# EAGLE design dual-dac-w-32-ch-sh-DAC-BOARD (EAGLE 7.2.0)
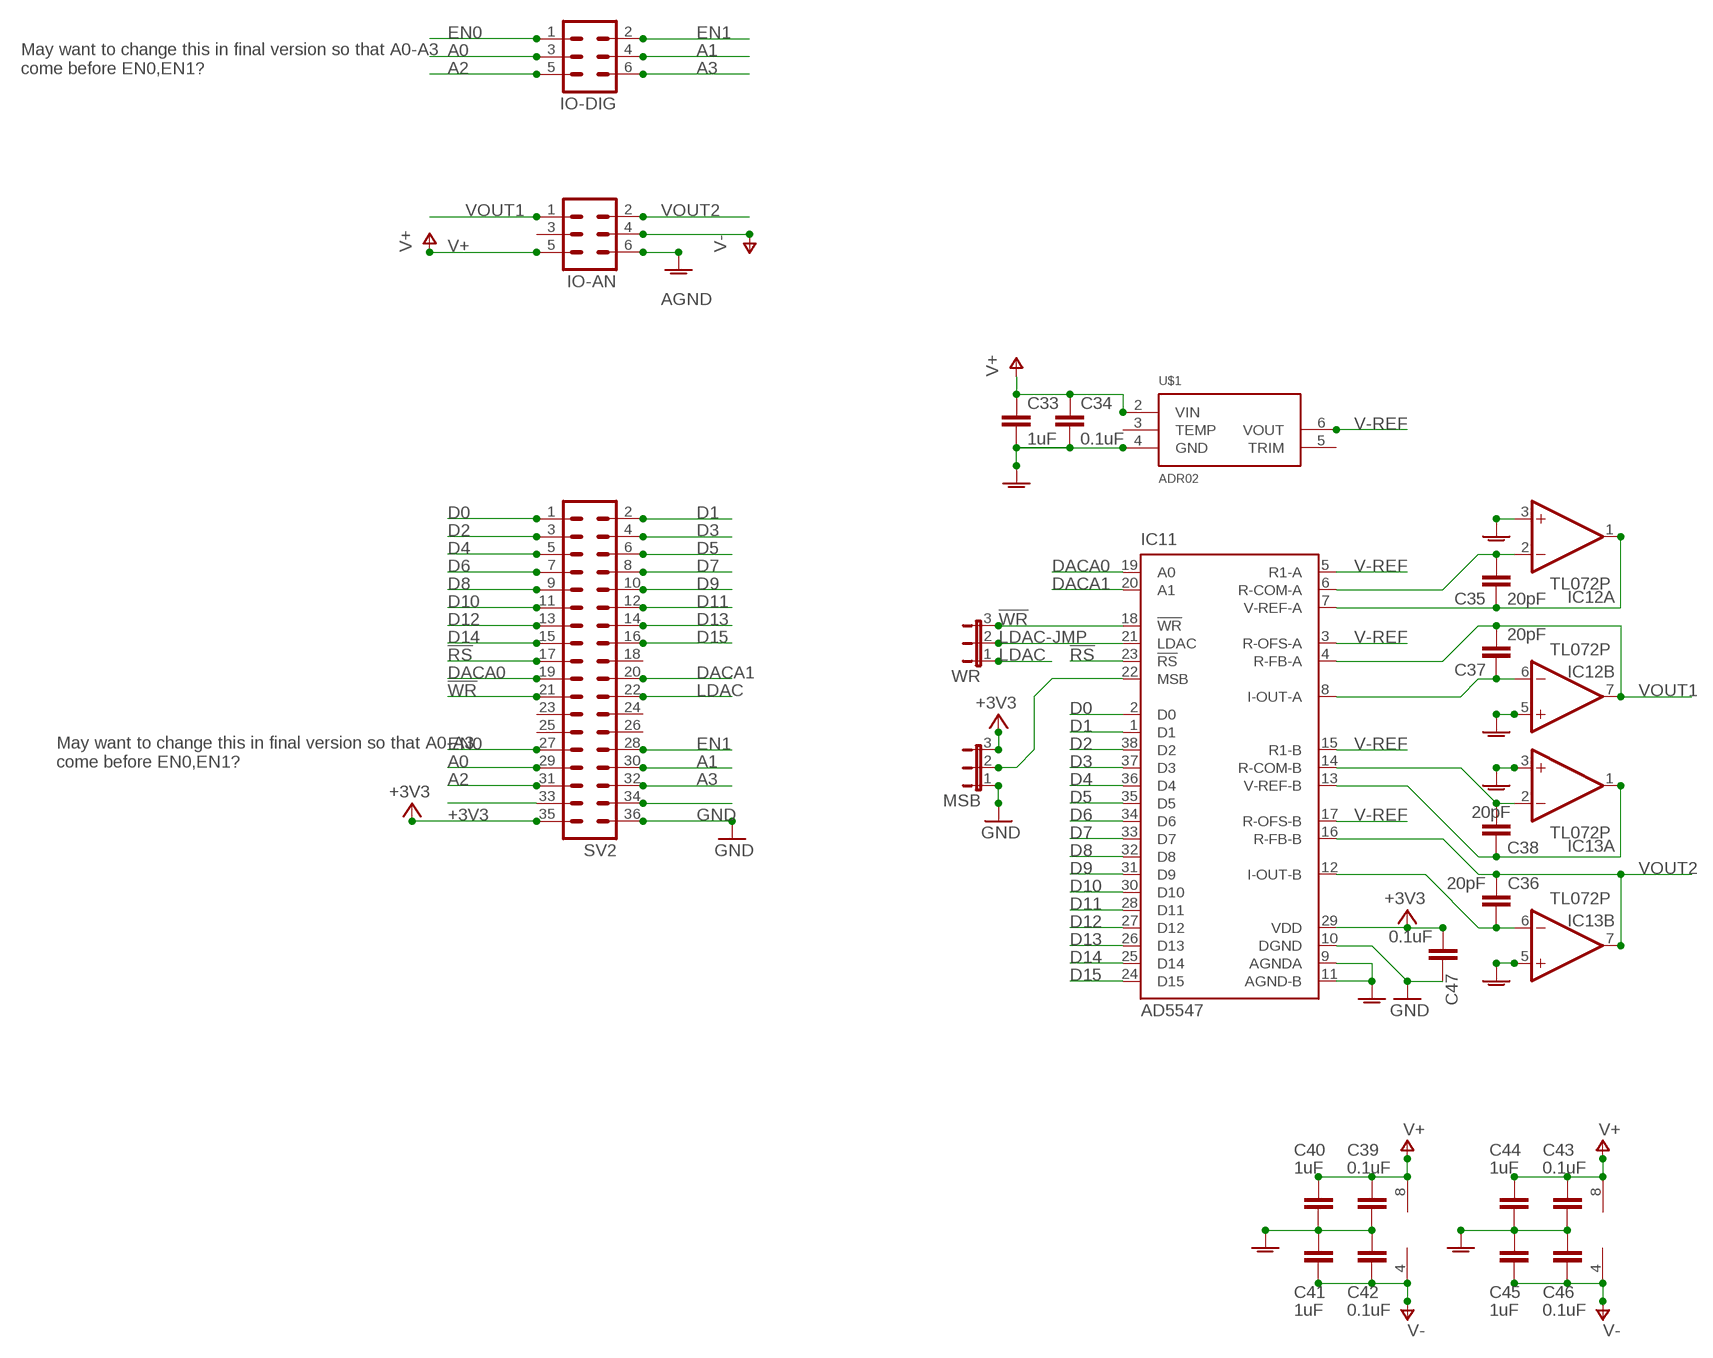
[diagram p0: schematic, sheet 1]

## Parts
C33  1uF  C-EUC0603  [C0603]
C34  0.1uF  C-EUC0603  [C0603]
C35  20pF  C-EUC0603  [C0603]
C36  20pF  C-EUC0603  [C0603]
C37  20pF  C-EUC0603  [C0603]
C38  20pF  C-EUC0603  [C0603]
C39  0.1uF  C-EUC0603  [C0603]
C40  1uF  C-EUC0603  [C0603]
C41  1uF  C-EUC0603  [C0603]
C42  0.1uF  C-EUC0603  [C0603]
C43  0.1uF  C-EUC0603  [C0603]
C44  1uF  C-EUC0603  [C0603]
C45  1uF  C-EUC0603  [C0603]
C46  0.1uF  C-EUC0603  [C0603]
C47  0.1uF  C-EUC0603  [C0603]
IC11  AD5547  [TSSOP38]
IC12  TL072P  [DIL08]
IC13  TL072P  [DIL08]
IO-AN  MA03-2  [MA03-2]
IO-DIG  MA03-2  [MA03-2]
MSB  JP2E  [JP2]
SV2  MA18-2  [MA18-2]
U$1  ADR02  [SO08]
WR  JP2E  [JP2]

## Nets
!RS: IC11.23(!RS) SV2.17
!WR: IC11.18(!WR) SV2.21 WR.3
+3V3: C47.1 IC11.29(VDD) MSB.3 SV2.35
A0: IO-DIG.3 SV2.29
A1: IO-DIG.4 SV2.30
A2: IO-DIG.5 SV2.31
A3: IO-DIG.6 SV2.32
AGND: C33.2 C34.2 C39.1 C40.1 C41.2 C42.2 C43.1 C44.1 C45.2 C46.2 IC11.9(AGNDA) IC11.11(AGND-B) IC12.3(A:+IN) IC12.5(B:+IN) IC13.3(A:+IN) IC13.5(B:+IN) IO-AN.6 U$1.4(GND)
D0: IC11.2(D0) SV2.1
D1: IC11.1(D1) SV2.2
D2: IC11.38(D2) SV2.3
D3: IC11.37(D3) SV2.4
D4: IC11.36(D4) SV2.5
D5: IC11.35(D5) SV2.6
D6: IC11.34(D6) SV2.7
D7: IC11.33(D7) SV2.8
D8: IC11.32(D8) SV2.9
D9: IC11.31(D9) SV2.10
D10: IC11.30(D10) SV2.11
D11: IC11.28(D11) SV2.12
D12: IC11.27(D12) SV2.13
D13: IC11.26(D13) SV2.14
D14: IC11.25(D14) SV2.15
D15: IC11.24(D15) SV2.16
DACA0: IC11.19(A0) SV2.19
DACA1: IC11.20(A1) SV2.20
EN0: IO-DIG.1 SV2.27
EN1: IO-DIG.2 SV2.28
GND: C47.2 IC11.10(DGND) MSB.1 SV2.36
LDAC: SV2.22 WR.1
LDAC-JMP: IC11.21(LDAC) WR.2
N$1: C35.2 IC11.6(R-COM-A) IC12.2(A:-IN)
N$2: C35.1 IC11.7(V-REF-A) IC12.1(A:OUT)
N$3: C38.2 IC11.14(R-COM-B) IC13.2(A:-IN)
N$5: C38.1 IC11.13(V-REF-B) IC13.1(A:OUT)
N$6: IC11.22(MSB) MSB.2
N$7: C36.2 IC11.12(I-OUT-B) IC13.6(B:-IN)
N$10: C37.2 IC11.8(I-OUT-A) IC12.6(B:-IN)
N$12: SV2.33
N$16: SV2.34
V+: C33.1 C34.1 C39.2 C40.2 C43.2 C44.2 IC12.8(P:V+) IC13.8(P:V+) IO-AN.5 U$1.2(VIN)
V-: C41.1 C42.1 C45.1 C46.1 IC12.4(P:V-) IC13.4(P:V-) IO-AN.4
V-REF: IC11.3(R-OFS-A) IC11.5(R1-A) IC11.15(R1-B) IC11.17(R-OFS-B) U$1.6(VOUT)
VOUT1: C37.1 IC11.4(R-FB-A) IC12.7(B:OUT) IO-AN.1
VOUT2: C36.1 IC11.16(R-FB-B) IC13.7(B:OUT) IO-AN.2
Unconnected: IO-AN.3 SV2.18 SV2.23 SV2.24 SV2.25 SV2.26 U$1.3(TEMP) U$1.5(TRIM)

## Notes on the sheet
- May want to change this in final version so that A0-A3 
  come before EN0,EN1?
- May want to change this in final version so that A0-A3 
  come before EN0,EN1?

## Library data of the parts
C33-C47 = resistor:C-EU: CAPACITOR, European symbol
IC11 = joakim:AD5547: Dual-Current Output, Parallel Input 16 bit Multiplying DAC Source: http://www.analog.com/media/en/technical-documentation/data-sheets/AD5547_5557.pdf
IC12 IC13 = linear:TL072: OP AMP
IO-AN IO-DIG = con-lstb:MA03-2: PIN HEADER; OC_FARNELL: unknown; OC_NEWARK: unknown
MSB WR = jumper:JP2E: JUMPER
SV2 = con-lstb:MA18-2: PIN HEADER; OC_FARNELL: unknown; OC_NEWARK: unknown
U$1 = joakim:ADR02: Ultracompact Precision 5.0V Voltage Reference Analog Devices http://docs-europe.electrocomponents.com/webdocs/10ad/0900766b810adbed.pdf

## Board
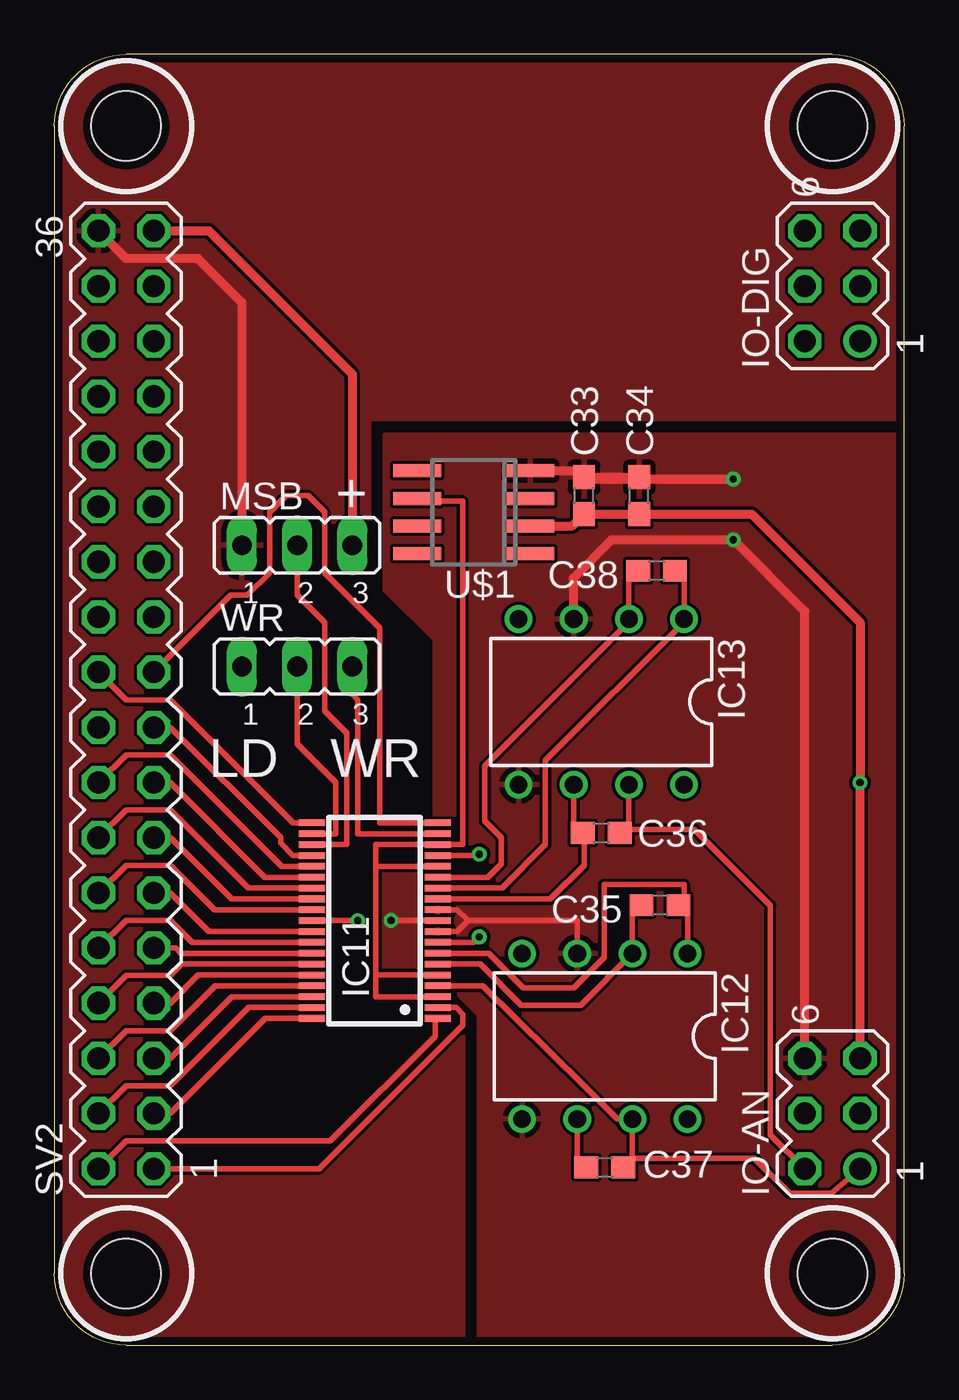
[diagram p1: board, top side]
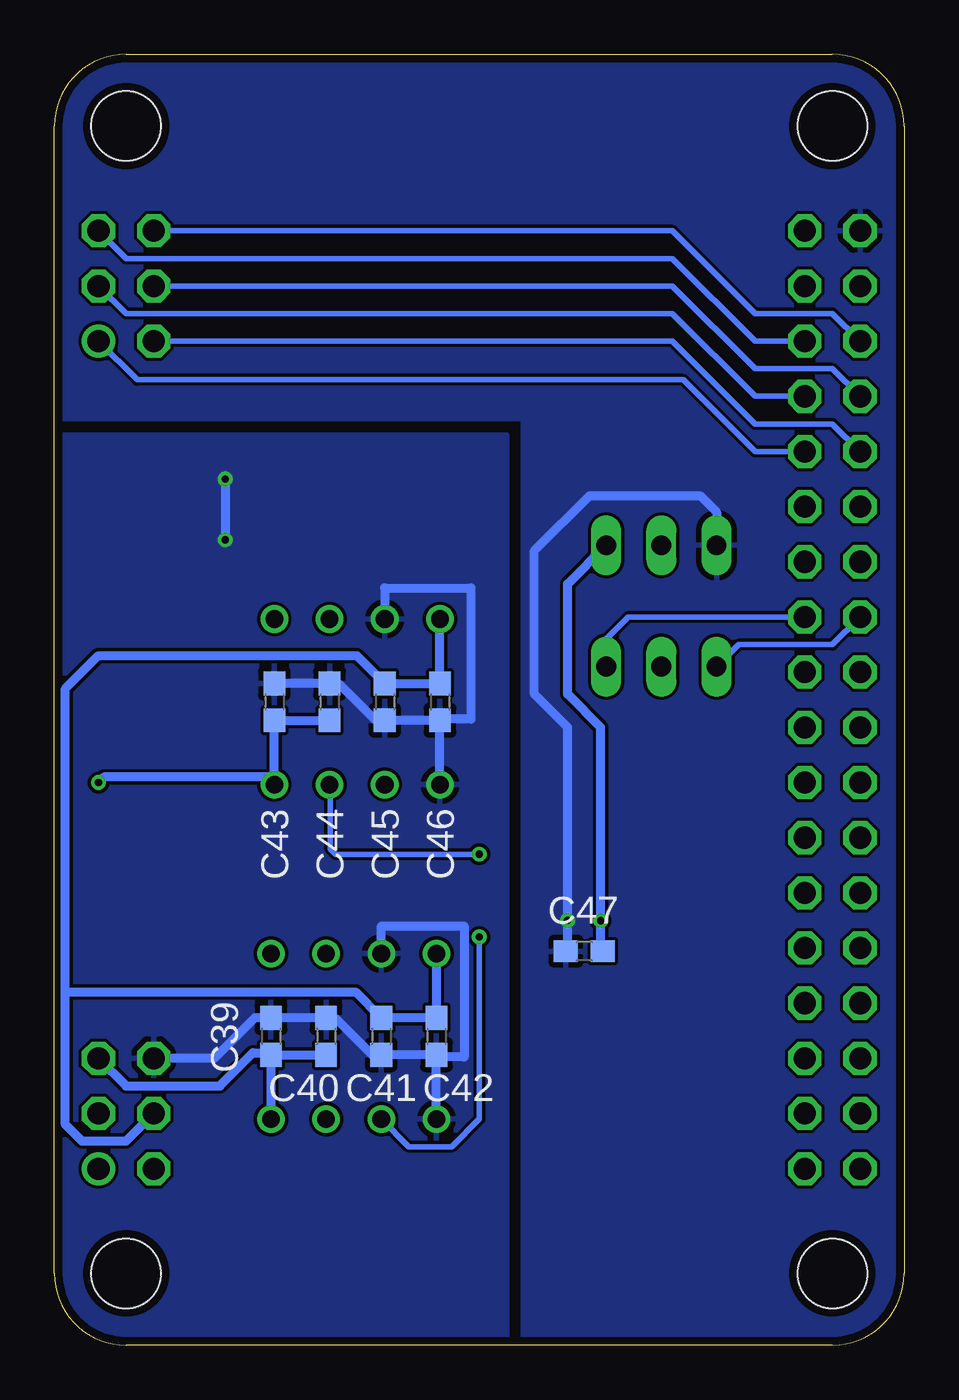
[diagram p2: board, bottom side, seen from below]

Size 39.12 x 59.44 mm. Coordinates in mm from the lower left corner, seen from the top.
Outline: 3.3,0 35.81,0 arc90 39.12,3.3 39.12,56.13 arc90 35.81,59.44 3.3,59.44 arc90 0,56.13 0,3.3 arc90 3.3,0
Copper layers (1*16): Top 0.0356mm / dielectric 1.5011mm / Bottom 0.0356mm
Design rules "LaenPCBOrder": minimum track width 6mil, minimum drill 13mil, track to track 6mil, track to pad 6mil, pad to pad 6mil, via to via 6mil, smd to smd 6mil, copper to edge 15mil, drill to drill 6mil, minimum pad ring 7mil, minimum via ring 7mil, stop-mask expansion 3mil, vias tented up to drill 0mil, thermal gap 10mil
Holes 3.2 mm at 3.3,56.13 35.81,56.13 3.3,3.3 35.81,3.3

### Footprints (pad centres in the part's own frame; a part is rotated, then mirrored left to right if it is on the bottom)
C0603 = smd 1.1 x 1: 1 -0.85,0; 2 0.85,0
TSSOP38 = smd 0.3 x 1.2: 1 -4.5,-2.9; 2 -4,-2.9; 3 -3.5,-2.9; 4 -3,-2.9; 5 -2.5,-2.9; 6 -2,-2.9; 7 -1.5,-2.9; 8 -1,-2.9; 9 -0.5,-2.9; 10 0,-2.9; 11 0.5,-2.9; 12 1,-2.9; 13 1.5,-2.9; 14 2,-2.9; 15 2.5,-2.9; 16 3,-2.9; 17 3.5,-2.9; 18 4,-2.9; 19 4.5,-2.9; 20 4.5,2.9; 21 4,2.9; 22 3.5,2.9; 23 3,2.9; 24 2.5,2.9; 25 2,2.9; 26 1.5,2.9; 27 1,2.9; 28 0.5,2.9; 29 0,2.9; 30 -0.5,2.9; 31 -1,2.9; 32 -1.5,2.9; 33 -2,2.9; 34 -2.5,2.9; 35 -3,2.9; 36 -3.5,2.9; 37 -4,2.9; 38 -4.5,2.9
DIL08 = drill 0.813 pad 1.27: 1 -3.81,-3.81; 2 -1.27,-3.81; 3 1.27,-3.81; 4 3.81,-3.81; 5 3.81,3.81; 6 1.27,3.81; 7 -1.27,3.81; 8 -3.81,3.81
MA03-2 = drill 1.016: 1 -2.54,-1.27 | drill 1.016 octagon: 2 -2.54,1.27; 3 0,-1.27; 4 0,1.27; 5 2.54,-1.27; 6 2.54,1.27
JP2 = drill 0.914 long: 1 -2.54,0; 2 0,0; 3 2.54,0
MA18-2 = drill 1.016 octagon: 1 -21.59,-1.27; 2 -21.59,1.27; 3 -19.05,-1.27; 4 -19.05,1.27; 5 -16.51,-1.27; 6 -16.51,1.27; 7 -13.97,-1.27; 8 -13.97,1.27; 9 -11.43,-1.27; 10 -11.43,1.27; 11 -8.89,-1.27; 12 -8.89,1.27; 13 -6.35,-1.27; 14 -6.35,1.27; 15 -3.81,-1.27; 16 -3.81,1.27; 17 -1.27,-1.27; 18 -1.27,1.27; 19 1.27,-1.27; 20 1.27,1.27; 21 3.81,-1.27; 22 3.81,1.27; 23 6.35,-1.27; 24 6.35,1.27; 25 8.89,-1.27; 26 8.89,1.27; 27 11.43,-1.27; 28 11.43,1.27; 29 13.97,-1.27; 30 13.97,1.27; 31 16.51,-1.27; 32 16.51,1.27; 33 19.05,-1.27; 34 19.05,1.27; 35 21.59,-1.27; 36 21.59,1.27
SO08 = smd 0.6 x 2.2: 1 -1.905,-2.6; 2 -0.635,-2.6; 3 0.635,-2.6; 4 1.905,-2.6; 5 1.905,2.6; 6 0.635,2.6; 7 -0.635,2.6; 8 -1.905,2.6

### Placement (x,y rotation side)
C33  24.38,39.12 90 top
C34  26.92,39.12 90 top
C35  27.88,20.26 180 top
C36  25.18,23.59 180 top
C37  25.34,8.19 180 top
C38  27.72,35.66 180 top
C39  29.15,14.22 270 bottom
C40  26.61,14.22 270 bottom
C41  24.07,14.22 270 bottom
C42  21.53,14.22 270 bottom
C43  28.99,29.62 270 bottom
C44  26.45,29.62 270 bottom
C45  23.91,29.62 270 bottom
C46  21.37,29.62 270 bottom
C47  14.72,18.14 180 bottom
IC11  14.74,19.55 90 top
IC12  25.34,14.22 180 top
IC13  25.18,29.62 180 top
IO-AN  35.81,10.67 90 top
IO-DIG  35.81,48.77 90 top
MSB  11.18,36.83 0 top
SV2  3.3,29.72 90 top
U$1  19.3,38.35 90 top
WR  11.18,31.24 0 top

### Tracks (layer width: path | path; a pad name or v marks a point on that pad's centre or on a via)
!RS
  Top 0.254: SV2.17 5.33,28.45 10.41,23.37 10.41,23.11 10.98,22.55 IC11.23
!WR
  Top 0.254: IC11.18 13.97,23.55 13.97,29.72 13.72,29.97 WR.3
  Bottom 0.254: SV2.21 12.7,33.53 13.72,32.51 WR.3
+3V3  (via drill 0.33)
  Top 0.254: IC11.29 v13.97,19.55
  Top 0.406: SV2.35 7.11,51.31 13.72,44.7 MSB.3
  Bottom 0.406: MSB.3 15.49,35.05 15.49,29.97 13.97,28.45 v13.97,19.55 13.97,18.03 C47.1
A0
  Bottom 0.254: SV2.29 6.86,43.69 10.67,47.5 35.81,47.5 IO-DIG.3
A1
  Bottom 0.254: SV2.30 3.3,44.96 6.86,44.96 10.67,48.77 IO-DIG.4
A2
  Bottom 0.254: SV2.31 6.86,46.23 10.67,50.04 35.81,50.04 IO-DIG.5
A3
  Bottom 0.254: SV2.32 3.3,47.5 6.86,47.5 10.67,51.31 IO-DIG.6
AGND  (via drill 0.33)
  Top 0.254: 17.64,19.07 IC11.9 18.54,19.05 19.05,19.56 | 19.05,19.56 18.54,20.05 IC11.11 | 19.05,19.56 24.07,19.56 IC12.3
  Top 0.406: IO-AN.6 34.54,33.78 v31.24,37.08 25.65,37.08 23.88,35.31 23.88,33.46 IC13.3 | C34.2 C33.2 24.09,40.26 U$1.4 24.26,40.26 24.64,39.88 v31.24,39.88
  Bottom 0.406: IC12.5 C42.2 | C42.2 C41.2 24.49,13.37 26.13,15.02 26.55,15.02 C40.1 C39.1 29.88,15.07 31.75,13.21 IO-AN.6 | IC13.5 C46.2 | C46.2 C45.2 24.33,28.77 25.97,30.42 26.39,30.42 C44.1 C43.1 | IC12.3 24.07,19.3 20.26,19.3 20.26,13.27 21.42,13.27 C42.2 | IC13.3 23.91,33.56 | C46.2 21.31,28.83 19.94,28.83 19.94,34.86 23.91,34.86 23.91,33.56 | 23.91,33.56 23.88,33.53 | v31.24,39.88 v31.24,37.08
  pour Top: 19.56,15.24 19.56,-0.76 39.88,-0.76 39.88,0 39.88,41.91 15.24,41.91 15.24,35.31 15.24,34.8 17.53,32.51 17.53,17.27
  pour Bottom: 40.13,-1.02 40.13,41.91 18.29,41.91 18.29,-1.02
D0
  Top 0.254: SV2.1 12.19,8.13 18.8,14.73 18.8,15.24 18.49,15.55 IC11.2
D1
  Top 0.254: SV2.2 3.3,9.4 12.7,9.4 17.53,14.22 17.53,14.93 IC11.1
D2
  Top 0.254: IC11.38 9.71,15.05 5.33,10.67 SV2.3
D3
  Top 0.254: IC11.37 8.94,15.55 5.33,11.94 3.3,11.94 SV2.4
D4
  Top 0.254: IC11.36 8.17,16.05 5.33,13.21 SV2.5
D5
  Top 0.254: IC11.35 7.4,16.55 5.33,14.48 3.3,14.48 SV2.6
D6
  Top 0.254: IC11.34 6.63,17.05 5.33,15.75 SV2.7
D7
  Top 0.254: IC11.33 5.86,17.55 5.33,17.02 3.3,17.02 SV2.8
D8
  Top 0.254: IC11.32 5.83,18.05 5.59,18.29 SV2.9
D9
  Top 0.254: IC11.31 6.34,18.55 5.33,19.56 3.3,19.56 SV2.10
D10
  Top 0.254: IC11.30 7.12,19.05 5.33,20.83 SV2.11
D11
  Top 0.254: IC11.28 7.38,20.05 5.33,22.1 3.3,22.1 SV2.12
D12
  Top 0.254: IC11.27 8.15,20.55 5.33,23.37 SV2.13
D13
  Top 0.254: IC11.26 8.93,21.05 5.33,24.64 3.3,24.64 SV2.14
D14
  Top 0.254: IC11.25 9.7,21.55 5.33,25.91 SV2.15
D15
  Top 0.254: IC11.24 10.46,22.05 5.33,27.18 3.3,27.18 SV2.16
DACA0
  Top 0.254: SV2.19 8.13,34.54 8.89,34.54 9.91,35.56 9.91,38.35 10.67,39.12 11.68,39.12 12.45,38.35 12.45,35.56 14.99,33.02 14.99,24.05 IC11.19
DACA1
  Top 0.254: SV2.20 3.3,29.72 5.33,29.72 11.01,24.05 IC11.20
EN0
  Bottom 0.254: SV2.27 6.86,41.15 10.16,44.45 35.31,44.45 IO-DIG.1
EN1
  Bottom 0.254: SV2.28 3.3,42.42 6.86,42.42 10.67,46.23 IO-DIG.2
GND  (via drill 0.33)
  Top 0.254: IC11.10 15.53,19.55 | 15.49,19.51 15.53,19.55 | 15.53,19.55 15.51,19.55 v15.49,19.56
  Top 0.406: SV2.36 3.3,50.04 6.6,50.04 8.64,48.01 MSB.1
  Bottom 0.406: MSB.1 8.64,38.35 9.4,39.12 14.48,39.12 17.02,36.58 17.02,29.97 15.49,28.45 v15.49,19.56 15.49,18.03 15.57,18.11 C47.2
  pour Bottom: 39.88,42.67 17.53,42.67 17.53,-0.76 -0.76,-0.76 -0.76,59.94 39.62,59.94 39.62,43.43 39.88,43.43
  pour Top: -0.51,60.2 39.88,60.2 39.88,42.67 39.62,42.67 14.48,42.67 14.48,34.54 16.76,32.26 16.76,16.51 18.8,14.48 18.8,0.25 0.51,0.25 0.51,56.9 -0.76,58.17 -0.76,59.94
LDAC
  Bottom 0.254: SV2.22 3.3,32.26 7.62,32.26 WR.1
LDAC-JMP
  Top 0.254: WR.2 11.18,27.69 12.95,25.91 12.95,23.55 IC11.21
N$1
  Top 0.254: C35.2 26.61,19.84 IC12.2 24.23,15.65 21.5,15.65 19.6,17.55 IC11.6
N$2
  Top 0.254: IC12.1 29.15,19.84 C35.1 28.99,20.52 28.99,21.21 25.3,21.21 25.3,17.84 23.91,16.45 21.59,16.45 19.99,18.05 IC11.7
N$3
  Top 0.254: C38.2 26.45,35.23 IC13.2 26.45,33.31 19.81,26.67 19.81,24.13 20.57,23.37 20.57,22.16 19.96,21.55 IC11.14
N$5
  Top 0.254: C38.1 28.99,35.23 IC13.1 28.99,33.31 22.61,26.92 22.61,23.05 20.61,21.05 IC11.13
N$6
  Top 0.254: IC11.22 13.46,23.05 13.46,28.19 12.45,29.21 12.45,33.27 11.18,34.54 MSB.2
N$7
  Top 0.254: IC13.6 23.91,24.01 C36.2 | 24.07,23.59 C36.2 | IC11.12 22.83,20.55 24.38,22.1 24.38,23.53 C36.2
N$10  (via drill 0.33)
  Top 0.254: IC12.6 24.07,8.61 C37.2 | IC11.8 19.31,18.55 v19.56,18.8
  Bottom 0.254: v19.56,18.8 19.56,10.41 20.83,9.14 22.8,9.14 IC12.6
V+  (via drill 0.33)
  Top 0.406: U$1.2 23.84,37.72 C33.1 C34.1 32.09,38.27 37.08,33.27 v37.08,25.91 IO-AN.5
  Bottom 0.406: C39.2 C40.2 | C39.2 IC12.8 | C44.2 C43.2 IC13.8 28.99,25.94 29.21,26.16 36.83,26.16 v37.08,25.91 | IO-AN.5 35.81,11.94 31.5,11.94 29.97,13.46 29.23,13.46 C39.2
V-
  Bottom 0.406: IC12.4 C42.1 C41.1 25.25,16.26 38.61,16.26 | IC13.4 C46.1 C45.1 25.18,31.75 37.08,31.75 38.61,30.23 38.61,16.26 | IO-AN.4 35.81,9.4 37.85,9.4 38.61,10.16 38.61,16.26
V-REF
  Top 0.254: IC11.17 | 14.8,22.05 14.8,17.05 | 14.8,17.05 14.8,16.05 IC11.3 | IC11.15 14.8,22.05 | IC11.5 14.8,17.05 | IC11.17 14.8,23.05 14.8,22.05 | IC11.17 18.8,23.05 18.8,38.86 16.83,38.86 U$1.6
VOUT1
  Top 0.254: 26.61,8.61 IC12.7 25.91,10.41 24.38,11.94 19.71,16.55 IC11.4 | 26.61,8.61 C37.1 | 26.61,8.61 32.22,8.61 33.85,6.98 35.75,6.98 IO-AN.1
VOUT2  (via drill 0.33)
  Top 0.254: IC13.7 26.45,24.01 C36.1 26.19,23.75 29.46,23.75 32.96,20.26 32.96,9.68 IO-AN.2 | IC11.16 19.5,22.55 v19.56,22.61
  Bottom 0.254: v19.56,22.61 26.16,22.61 26.42,22.86 26.42,25.78 IC13.7

### Text on the board
tNames: + | LD | WR